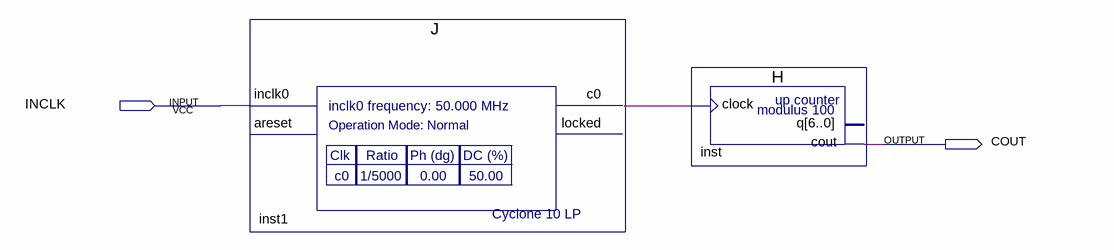
[diagram p0: schematic sheet]
// Quartus schematic FPQ.bdf as structural Verilog: 2 symbols, 2 pins
module FPQ (
  input  INCLK,
  output COUT
);

  wire inst1_c0;

  J inst1 (.inclk0(INCLK), .c0(inst1_c0));  // open: areset, locked
  H inst (.clock(inst1_c0), .cout(COUT));  // open: q
endmodule
